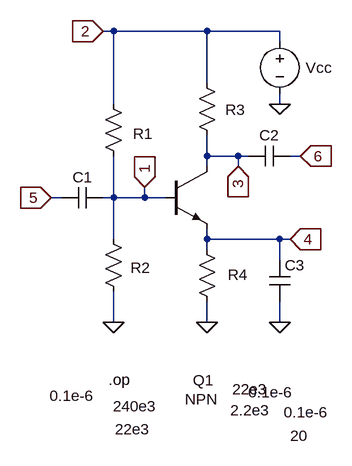
[diagram p0: schematic BJT_CE_amp.asc]
BJT_CE_amp.asc, the LTspice schematic file:
Version 4
SHEET 1 880 680
WIRE 112 -80 96 -80
WIRE 256 -80 112 -80
WIRE 368 -80 256 -80
WIRE 368 -64 368 -80
WIRE 256 0 256 -80
WIRE 112 32 112 -80
WIRE 368 32 368 16
WIRE 256 112 256 80
WIRE 304 112 256 112
WIRE 320 112 304 112
WIRE 400 112 384 112
WIRE 256 128 256 112
WIRE 304 128 304 112
WIRE 32 176 16 176
WIRE 112 176 112 112
WIRE 112 176 96 176
WIRE 160 176 160 160
WIRE 160 176 112 176
WIRE 192 176 160 176
WIRE 112 240 112 176
WIRE 256 240 256 224
WIRE 368 240 256 240
WIRE 384 240 368 240
WIRE 256 256 256 240
WIRE 368 272 368 240
WIRE 112 368 112 320
WIRE 256 368 256 336
WIRE 368 368 368 336
FLAG 368 32 0
FLAG 256 368 0
FLAG 112 368 0
FLAG 16 176 5
IOPIN 16 176 In
FLAG 304 128 3
IOPIN 304 128 In
FLAG 384 240 4
IOPIN 384 240 In
FLAG 96 -80 2
IOPIN 96 -80 In
FLAG 368 368 0
FLAG 400 112 6
IOPIN 400 112 In
FLAG 160 160 1
IOPIN 160 160 In
SYMBOL npn 192 128 R0
WINDOW 0 42 329 Left 2
WINDOW 3 30 358 Left 2
SYMATTR InstName Q1
SYMBOL res 96 16 R0
WINDOW 0 46 62 Left 2
WINDOW 3 15 481 Left 2
SYMATTR InstName R1
SYMATTR Value 240e3
SYMBOL res 96 224 R0
WINDOW 0 42 60 Left 2
WINDOW 3 18 308 Left 2
SYMATTR InstName R2
SYMATTR Value 22e3
SYMBOL res 240 240 R0
WINDOW 0 48 55 Left 2
WINDOW 3 52 263 Left 2
SYMATTR InstName R4
SYMATTR Value 2.2e3
SYMBOL res 240 -16 R0
WINDOW 0 44 57 Left 2
WINDOW 3 55 487 Left 2
SYMATTR InstName R3
SYMATTR Value 22e3
SYMBOL voltage 368 -80 R0
WINDOW 0 40 56 Left 2
WINDOW 3 16 622 Left 2
SYMATTR InstName Vcc
SYMATTR Value 20
SYMBOL cap 352 272 R0
WINDOW 3 22 234 Left 2
SYMATTR Value 0.1e-6
SYMATTR InstName C3
SYMBOL cap 384 96 R90
WINDOW 0 0 32 VBottom 2
WINDOW 3 364 30 VTop 2
SYMATTR InstName C2
SYMATTR Value 0.1e-6
SYMBOL cap 96 160 R90
WINDOW 0 0 32 VBottom 2
WINDOW 3 305 48 VTop 2
SYMATTR InstName C1
SYMATTR Value 0.1e-6
TEXT 104 456 Left 2 !.op

The netlist it stands for:
* BJT_CE_amp.asc
Q1 3 1 4 0 NPN
R1 2 1 240e3
R2 1 0 22e3
R4 4 0 2.2e3
R3 2 3 22e3
Vcc 2 0 20
C3 4 0 0.1e-6
C2 6 3 0.1e-6
C1 1 5 0.1e-6
.model NPN NPN
.model PNP PNP
.lib standard.bjt
.op
.backanno
.end